# Altium schematic sheet Sheet1.SchDoc
size A4; SheetNumber: 1; SheetTotal: 1
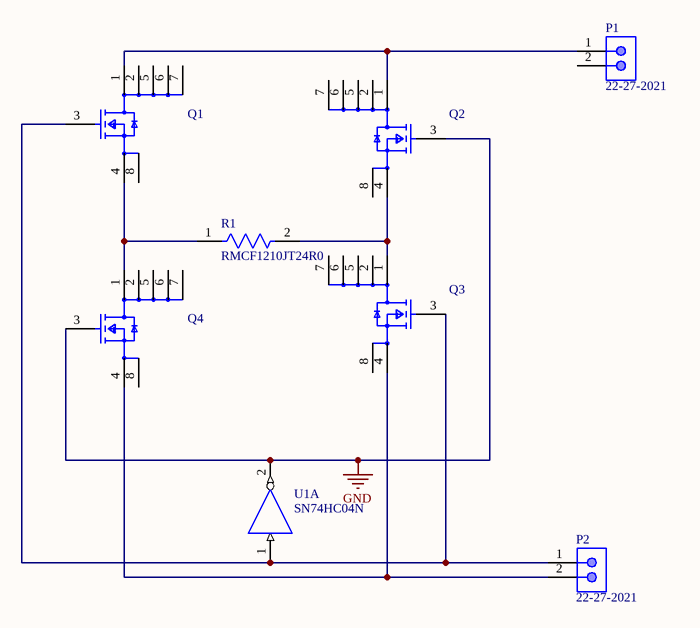
[diagram p0: Sheet1.SchDoc]

## Parts
P1  22-27-2021  [PIN]
P2  22-27-2021  [PIN]
Q1  IRL60HS118  [NMOS]  (value not drawn)
Q2  IRL60HS118  [NMOS]  (value not drawn)
Q3  IRL60HS118  [NMOS]  (value not drawn)
Q4  IRL60HS118  [NMOS]  (value not drawn)
R1  RMCF1210JT24R0  [FP-RMCF1210-IPC_B]
U1  SN74HC04N  [NOT]  (part A of 7)

## Nets
GND: Q2.3(G) Q4.3(G) U1.2(~{1Y})
NetP1_1: P1.1 Q1.1(D) Q2.1(D)
NetP2_1: P2.1 Q1.3(G) Q3.3(G) U1.1(1A)
NetP2_2: P2.2 Q3.4(S) Q4.4(S)
NetQ1_4: Q1.4(S) Q4.1(D) R1.1
NetQ2_4: Q2.4(S) Q3.1(D) R1.2

Not connected (* = marked no-connect by the designer): P1 2; Q1 2(D) 5(D) 6(D) 7(D) 8(S); Q2 2(D) 5(D) 6(D) 7(D) 8(S); Q3 2(D) 5(D) 6(D) 7(D) 8(S); Q4 2(D) 5(D) 6(D) 7(D) 8(S)

## Library data of the parts
P1 P2 = PIN: Male Header, Pitch 2.54 mm, 1 x 2 Position, Height 11.7 mm, Tail Length 3.56 mm, 0 to 75 degC, RoHS, Bulk; Manufacturer: Molex; PartNumber: 0022272021; Current rating: 4A; Package Version: Rev. BC, 02/2012; Voltage rating: 250V; No. of Positions: 2; Pitch: 2.54mm; No. of Rows: 1; Orientation: Vertical; Operating temperature: 0°Cto+75°C; Manufacturer URL: http://www.molex.com/; Mounting Technology: ThroughHole; Housing material: Nylon(UL94V-0); Package Description: 2-Leads Header, Body 5.08 x 5.8 mm, Pitch 2.54 mm; Voltage - Max: 250V; Datasheet URL: http://www.molex.com/pdm_docs/sd/022272021_sd.pdf; Package Reference: 22-27-2021; Contact material: Tinplatedbrass; Current - Max: 4A; Datasheet Version: Rev. F, 06/2009
Q1-Q4 = NMOS: MOSFET N-CH 60V 18.5A 6PQFN; Input Capacitance: 660pF; Max Power Dissipation: 11.5W; Rds On Max: 17mR; Max Operating Temperature: 175°C; Min Operating Temperature: -55°C; RoHS Compliant: Yes; Drain to Source Voltage (Vdss): 60V; Halogen Free: Halogen Free; Continuous Drain Current (ID): 18.5A; Packaging: Cut Tape; Lead Free: Lead Free; Max Dual Supply Voltage: 60V; Mount: Surface Mount
R1 = RESISTOR: 24Ω ±5% 0.5W 1210 Thick Film Chip Resistor AEC-Q200 compliant; Resistance: 24R; Temperature Coefficient: 200ppm/°C; Max Power Dissipation: 500mW; Contact Plating: Tin; Length: 0.126inch; Series: RMCF; Radiation Hardening: No; Width: 0.098inch; Height: 0.028inch; Packaging: Tape and Reel; RoHS Compliant: Yes; Tolerance: 5%; Case/Package: 1210; Resistor Type: Thick Film; Number of Terminations: 2; Min Operating Temperature: -55°C; Features: Automotive AEC-Q200; Mount: Surface Mount; Max Operating Temperature: 155°C
U1 = NOT: Hex Inverters, N0014A, TUBE; Manufacturer: Texas Instruments; VCC(Min)(V): 2; Bits(#): 6; Technology Family: HC; tpd @ Nom Voltage(Max)(ns): 20; Output Drive (IOL/IOH)(Max)(mA): -4/4; Rating: Catalog; Voltage(Nom)(V): 5; Schmitt Trigger: No; ICC @ Nom Voltage(Max)(mA): 0.02; Input Type: CMOS; Code_JEDEC: MS-001; PackageReference: N0014A; DatasheetVersion: SCLS078F; Output Type: CMOS; VCC(Max)(V): 6; Operating Temperature Range(C): -40 to 85; Generic Part Number: SN74HC04; F @ Nom Voltage(Max)(Mhz): 20